# Altium project DSDLink.PrjPCB
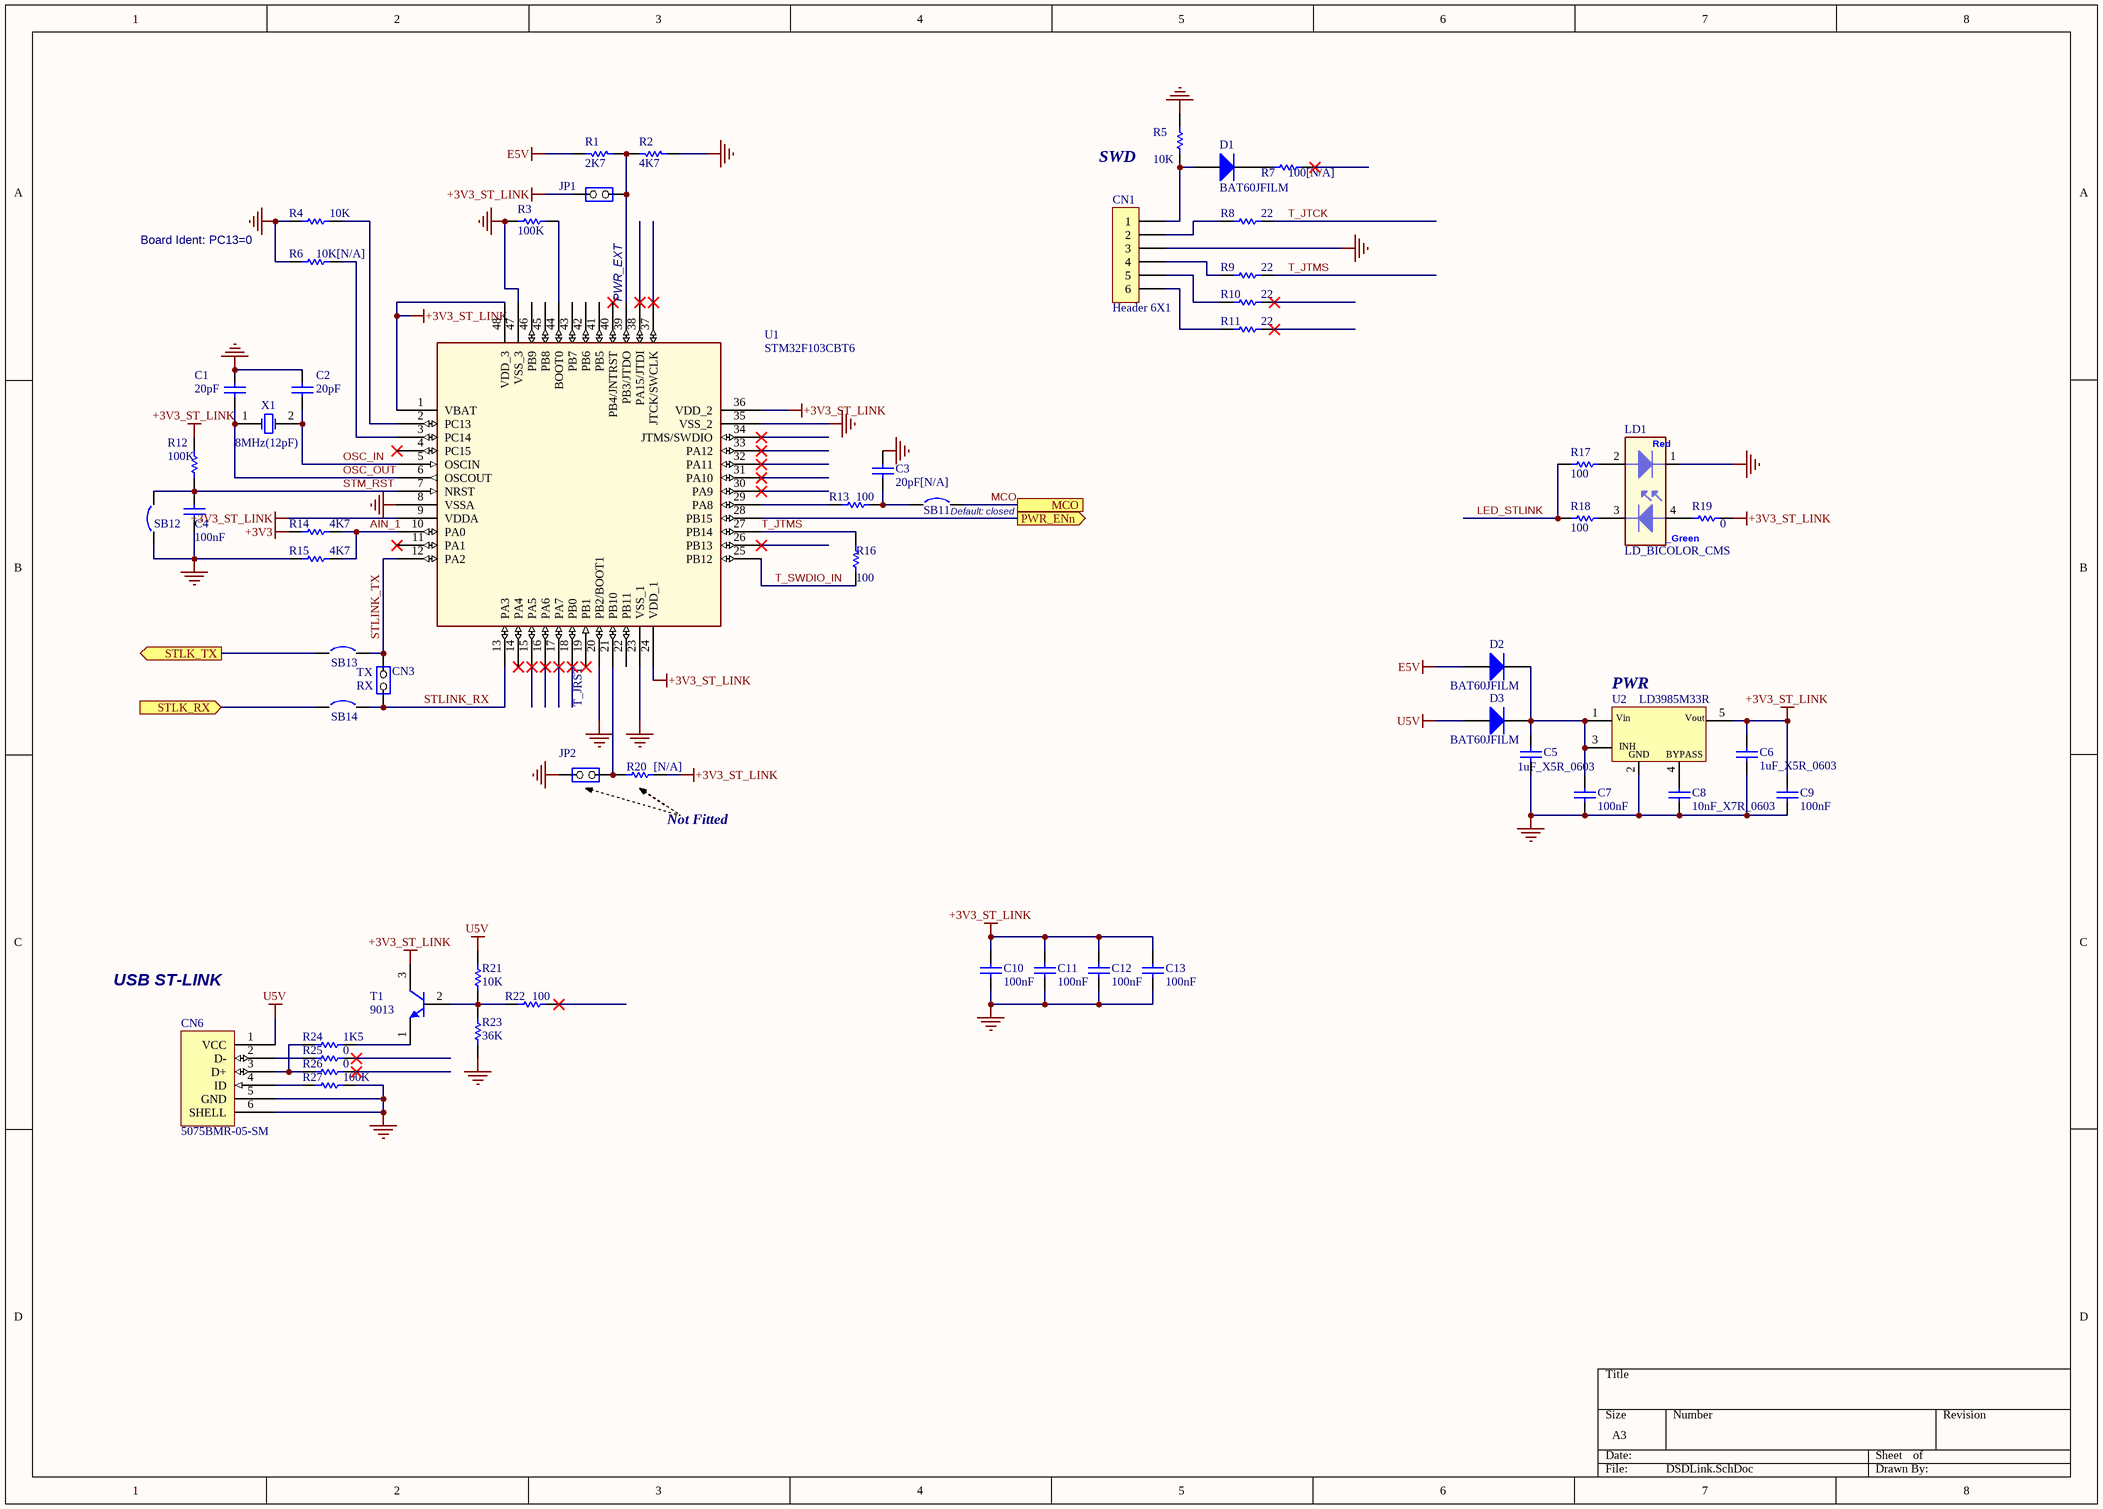
[diagram p0: DSDLink.SchDoc]
1 sheet, 57 parts. Net scope: flat (ports and power ports of the same name join across sheets).
Board file: DSDLink.PcbDoc

## Sheet DSDLink.SchDoc
size A3

### Parts
C1  20pF  [0603C]
C2  20pF  [0603C]
C3  20pF[N/A]  [0603C]
C4  100nF  [0603C]
C5  1uF_X5R_0603  [0603C]
C6  1uF_X5R_0603  [0603C]
C7  100nF  [0603C]
C8  10nF_X7R_0603  [0603C]
C9  100nF  [0603C]
C10  100nF  [0603C]
C11  100nF  [0603C]
C12  100nF  [0603C]
C13  100nF  [0603C]
CN1  Header 6X1  [1*6P]
CN3  (no value)  [SIP2/2.54]
CN6  5075BMR-05-SM  [USB-MINI-B-SMD]
D1  BAT60JFILM  [SOD323/A]
D2  BAT60JFILM  [SOD323/A]
D3  BAT60JFILM  [SOD323/A]
JP1  (no value)  [SIP2/2.54]
JP2  (no value)  [SIP2/2.54]
LD1  LD_BICOLOR_CMS  [HSMF-A201]
R1  2K7  [0603R]
R2  4K7  [0603R]
R3  100K  [0603R]
R4  10K  [0603R]
R5  10K  [0603R]
R6  10K[N/A]  [0603R]
R7  100[N/A]  [0603R]
R8  22  [0603R]
R9  22  [0603R]
R10  22  [0603R]
R11  22  [0603R]
R12  100K  [0603R]
R13  100  [0603R]
R14  4K7  [0603R]
R15  4K7  [0603R]
R16  100  [0603R]
R17  100  [0603R]
R18  100  [0603R]
R19  0  [0603R]
R20  [N/A]  [0603R]
R21  10K  [0603R]
R22  100  [0603R]
R23  36K  [0603R]
R24  1K5  [0603R]
R25  0  [0603R]
R26  0  [0603R]
R27  100K  [0603R]
SB11  Circuit Breaker  [JP2_SMD]  (value not drawn)
SB12  Circuit Breaker  [JP2_SMD]  (value not drawn)
SB13  Circuit Breaker  [JP2_SMD]  (value not drawn)
SB14  Circuit Breaker  [JP2_SMD]  (value not drawn)
T1  9013  [SOT-23]
U1  STM32F103CBT6  [QFP48 7X7]
U2  LD3985M33R  [SOT-23-5L]
X1  8MHz(12pF)  [XTAL1]

### Ports
MCO, PWR_ENn (out), STLK_RX (in), STLK_TX (out)

### Nets
+3V3: R14.1
+3V3_ST_LINK: C6.1 C9.2 C10.2 C11.2 C12.2 C13.2 JP1.1(COMMON) R12.2 R19.2 R20.1 T1.3(C) U1.1(VBAT) U1.9(VDDA) U1.24(VDD_1) U1.36(VDD_2) U1.48(VDD_3) U2.5(Vout)
E5V: D2.1(A) R1.1
GND: C1.2 C2.2 C3.2 C4.1 C5.1 C6.2 C7.1 C8.1 C9.1 C10.1 C11.1 C12.1 C13.1 CN1.3 CN6.5(GND) CN6.6(SHELL) JP2.1(COMMON) LD1.1 R2.2 R3.1 R4.1 R5.2 R6.1 R15.1 R23.1 R27.2 SB12.1 U1.8(VSSA) U1.20(PB2/BOOT1) U1.23(VSS_1) U1.35(VSS_2) U1.47(VSS_3) U2.2(GND)
U5V: CN6.1(VCC) D3.1(A) R21.2
AIN_1: R14.2 R15.2 U1.10(PA0)
LED_STLINK: R17.1 R18.1
MCO: SB11.2 ; port MCO
OSC_IN: C2.1 U1.5(OSCIN) X1.2(OSC2)
OSC_OUT: C1.1 U1.6(OSCOUT) X1.1(OSC1)
STLINK_RX: CN3.1(COMMON) SB14.2 U1.13(PA3)
STLINK_TX: CN3.2(NO) SB13.2 U1.12(PA2)
STM_RST: C4.2 R12.1 SB12.2 U1.7(NRST)
T_JTCK: R8.2
T_JTMS: R9.2 R16.2 U1.27(PB14)
T_SWDIO_IN: R16.1 U1.25(PB12)
NetC3_1: C3.1 R13.2 SB11.1
NetC5_2: C5.2 C7.2 D2.2(K) D3.2(K) U2.1(Vin) U2.3(CE)
NetC8_2: C8.2 U2.4(BYPASS)
NetCN1_1: CN1.1 D1.1(A) R5.1
NetCN1_2: CN1.2 R8.1
NetCN1_4: CN1.4 R9.1
NetCN1_5: CN1.5 R10.1
NetCN1_6: CN1.6 R11.1
NetCN6_2: CN6.2(D-) R25.1
NetCN6_3: CN6.3(D+) R24.1 R26.1
NetCN6_4: CN6.4(ID) R27.1
NetD1_2: D1.2(K) R7.1
NetJP1_2: JP1.2(NO) R1.2 R2.1 U1.39(PB3/JTDO)
NetJP2_2: JP2.2(NO) R20.2 U1.21(PB10)
NetLD1_2: LD1.2 R17.2
NetLD1_3: LD1.3 R18.2
NetLD1_4: LD1.4 R19.1
NetR3_2: R3.2 U1.44(BOOT0)
NetR4_2: R4.2 U1.2(PC13)
NetR6_2: R6.2 U1.3(PC14)
NetR13_1: R13.1 U1.29(PA8)
NetR21_1: R21.1 R22.1 R23.2 T1.2(B)
NetR24_2: R24.2 T1.1(E)
NetSB13_1: SB13.1 ; port STLK_TX
NetSB14_1: SB14.1 ; port STLK_RX
NetU1_28: U1.28(PB15) ; port PWR_ENn

Not connected (* = marked no-connect by the designer): R7 2*; R10 2*; R11 2*; R22 2*; R25 2*; R26 2*; U1 4(PC15)* 11(PA1)* 14(PA4)* 15(PA5)* 16(PA6)* 17(PA7)* 18(PB0)* 19(PB1)* 22(PB11) 26(PB13)* 30(PA9)* 31(PA10)* 32(PA11)* 33(PA12)* 34(JTMS/SWDIO)* 37(JTCK/SWCLK)* 38(PA15/JTDI)* 40(PB4/JNTRST)* 41(PB5) 42(PB6) 43(PB7) 45(PB8) 46(PB9)

### Notes on the sheet
- SWD
- Board Ident: PC13=0
- (near U1) PWR_EXT
- (near SB11) Default: closed
- TX
- RX
- T_JRST
- (near U2) PWR
- (near R20) Not Fitted
- USB ST-LINK
- (in symbol LD3985M33R) INH
- (in symbol LD_BICOLOR_CMS) Red; _Green

### Library data of the parts
C1-C3 = Capacitor_ST: Capacitor 0402 / 0603 / 0805; Value: 100nF; Revision: July-2002: Re-released for DXP Platform.
C4 C7 C9-C13 = Capacitor_ST: Capacitor 0402 / 0603 / 0805; Revision: July-2002: Re-released for DXP Platform.; Value: 100nF
C5 C6 = CAP SMD 0603  X5R 1µF 25V 10%: 0603  X5R 1µF; Rated voltage: 25V; Tolerance: 10%; Manufacturer: *; Manufacturer P/N: *; Order code Farnell: 1288202RL; Value: 1µF; Power: *; Technology: X5R; Temperature  Factor: *; Temperature Max: +125°C; Temperature Min: -55°C; STS Code: *
C8 = CAP SMD 0603  X7R 10000PF 50V 10%: 0603  X7R 10NF; Order code RS: 2040779; Rated voltage: 50V; Tolerance: 10%; Order code Farnell: 7569548RL; Value: 10NF; Power: *; Technology: X7R; Temperature Factor: *; Temperature Min: -55°C; Temperature Max: +125°C; STS Code: *
CN1 = Header 6X1: Header, 6-Pin, Single row; LatestRevisionDate: 17-Jul-2002; LatestRevisionNote: Re-released for DXP Platform.; Publisher: Altium Limited
CN3 = JP2: Fitted: NO
CN6 = USB-MINI-typeB connector: Manuf_Part_1: 5075BMR-05-SM; Order: 5075BMR-05-SM; ECCN: ????
D1-D3 = BAT60JFILM: Manuf_1: STM; Provided: ST; ECCN_US/EU: EAR99/NEC; Revision: July-2002: Re-released for DXP Platform.; Order: BAT60JFILM; Manuf_Part_1: BAT60JFILM; Distrib: ST
JP1 JP2 = JP2
LD1 = LD_BICOLOR_CMS: Bicolor Led; Manuf_Part_1: HSMF-A201-A00J1; Manuf_1: Avago Technologies; Ref St: xxxxxx; cap_dec: ----; Distrib: RADIOSPARES
R1 R2 R20 R21 R23 = Res1: Resistor; Value: 1K; Published: 8-Jun-2000; Revision: July-2002: Re-released for DXP Platform.; Publisher: Altium Limited
R3 R7-R13 R16-R19 R22 R24-R27 = Resistor_ST: Resistor 0402 / 0603 / 0805; Value: 10K
R4 R5 = Resistor_ST: Resistor 0402 / 0603 / 0805; Value: 10K
R6 R14 R15 = Resistor_ST: Resistor 0402 / 0603 / 0805; Value: 10K; Fitted: NO
SB11-SB14 = Circuit Breaker: Solder: NO; Published: 24-Mar-1999; Revision: July-2002: Re-released for DXP Platform.; Publisher: Altium Limited
T1 = NPN: NPN Bipolar Transistor; Code - JEDEC: TO-226-AA; Published: 8-Jun-2000; Revision: July-2002: Re-released for DXP Platform.; Publisher: Altium Limited
U1 = STM32F103CBT6: Medium-density performance line ARM-based 32-bit MCU with 64KB Flash; Manuf_Part_1: STM32F103C8T6; Manuf_1: STM; Ref St: 9175981; Provided: ST; ECCN_US/EU: 3A991A2/NEC; Distrib: ST; Order: STM32F103C8T6
U2 = LD3985M33R: Ultra low drop-low noise BiCMOS voltage, regulators low ESR capacitors compatible; Manuf_1: STM; Provided: ST; Ref St: 9176161; ECCN_US/EU: EAR99/NEC; Manuf_Part_1: LD3985M33R; Distrib: ST; Order: LD3985M33R
X1 = XTAL: Crystal Oscillator; Published: 8-Jun-2000; LatestRevisionDate: 17-Jul-2002; LatestRevisionNote: Re-released for DXP Platform.; PackageReference: R38; Publisher: Altium Limited